# EAGLE design DACEM_Final_Bckup (EAGLE 8.4.3)
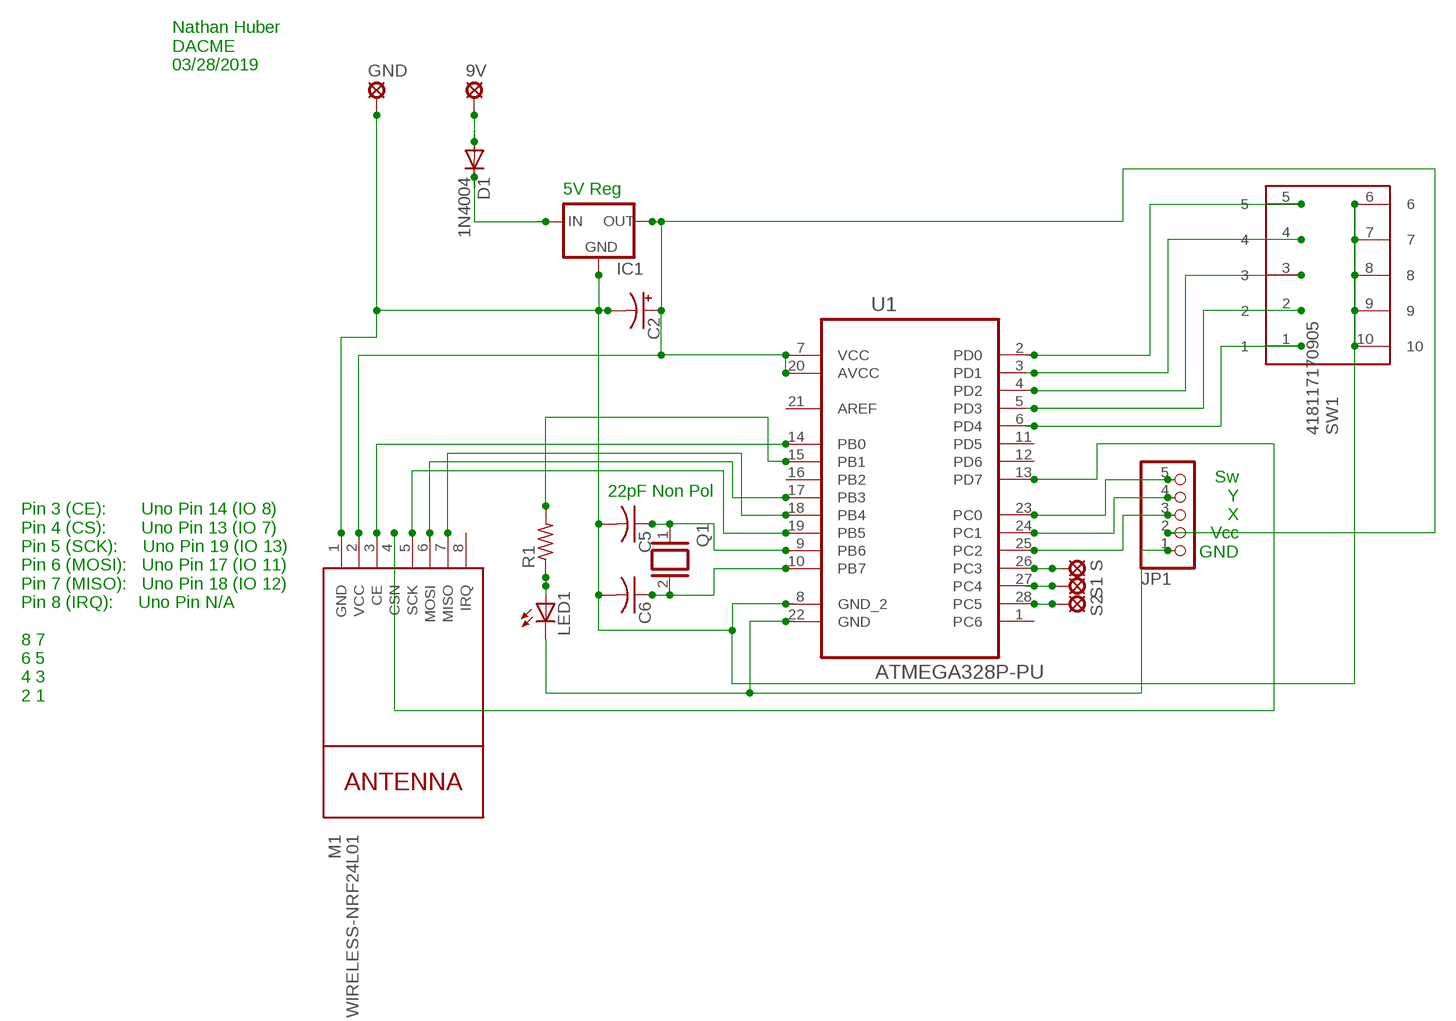
[diagram p0: schematic, sheet 1]

## Parts
9V  LSP10  [LSP10]
C2  CPOL-USE1.8-4  [E1,8-4]
C5  C-US025-025X050  [C025-025X050]
C6  C-US025-025X050  [C025-025X050]
D1  1N4004  [DO41-10]
GND  LSP10  [LSP10]
IC1  78XXS  [78XXS]
JP1  PINHD-1X5  [1X05]
LED1  LED3MM  [LED3MM]
M1  WIRELESS-NRF24L01  [WIRELESS-NRF24L01]
Q1  XTAL  [Q]
R1  R-US_0207/15  [0207/15]
S  LSP10  [LSP10]
S1  LSP10  [LSP10]
S2  LSP10  [LSP10]
SW1  418117170905  [418117170905]
U1  ATMEGA328P-PU  [DIP254P762X457-28]

## Nets
N$1: C2.- C5.2 C6.2 GND.MP IC1.GND M1.1(GND) SW1.6 SW1.7 SW1.8 SW1.9 SW1.10 U1.8(GND_2)
N$2: M1.7(MISO) U1.18(PB4)
N$3: JP1.5 U1.23(PC0)
N$4: C2.+ IC1.OUT JP1.2 M1.2(VCC) U1.7(VCC) U1.20(AVCC)
N$6: SW1.5 U1.2(PD0)
N$7: JP1.1 LED1.K(C) U1.22(GND)
N$8: JP1.4 U1.24(PC1)
N$9: JP1.3 U1.25(PC2)
N$10: C6.1 Q1.2 U1.10(PB7)
N$11: SW1.4 U1.3(PD1)
N$12: SW1.3 U1.4(PD2)
N$13: C5.1 Q1.1 U1.9(PB6)
N$14: SW1.2 U1.5(PD3)
N$15: M1.3(CE) U1.14(PB0)
N$16: M1.4(CSN) U1.13(PD7)
N$17: M1.5(SCK) U1.19(PB5)
N$18: M1.6(MOSI) U1.17(PB3)
N$19: SW1.1 U1.6(PD4)
N$21: R1.2 U1.15(PB1)
N$22: LED1.A R1.1
N$23: D1.C IC1.IN
N$24: 9V.MP D1.A
N$25: S.MP U1.26(PC3)
N$26: S1.MP U1.27(PC4)
N$27: S2.MP U1.28(PC5)
Unconnected: M1.8(IRQ) U1.1(PC6) U1.11(PD5) U1.12(PD6) U1.16(PB2) U1.21(AREF)

## Notes on the sheet
- Nathan Huber
  DACME
  03/28/2019
- 5V Reg
- Sw
  Y
  X
  Vcc
  GND
- 22pF Non Pol
- Pin 3 (CE):       Uno Pin 14 (IO 8)
  Pin 4 (CS):       Uno Pin 13 (IO 7)
  Pin 5 (SCK):     Uno Pin 19 (IO 13)
  Pin 6 (MOSI):   Uno Pin 17 (IO 11)
  Pin 7 (MISO):   Uno Pin 18 (IO 12)
  Pin 8 (IRQ):     Uno Pin N/A
  
  8 7
  6 5
  4 3
  2 1

## Library data of the parts
9V GND S S1 S2 = solpad:LSP10: SOLDER PAD drill 1.0 mm, distributor Buerklin, 12H555
C2 = rcl:CPOL-US: POLARIZED CAPACITOR, American symbol
C5 C6 = rcl:C-US: CAPACITOR, American symbol
D1 = diode:1N4004: DIODE general purpose rectifier, 1 A
IC1 = v-reg:78XXS: VOLTAGE REGULATOR
JP1 = pinhead:PINHD-1X5: PIN HEADER
LED1 = led:LED: LED OSRAM: - CHIPLED LG R971, LG N971, LY N971, LG Q971, LY Q971, LO R971, LY R971 LH N974, LH R974 LS Q976, LO Q976, LY Q976 LO Q996 - Hyper CHIPLED LW Q18S LB Q993, LB Q99A, LB R99A - SideLED LS A670, LO A670, LY A670, LG A670, LP A670 LB A673, LV A673, LT A673, LW A673 LH A674 LY A675 LS A676, LA A676, LO A676, LY A676, LW A676 LS A679, LY A679, LG A679 - Hyper Micro SIDELED® LS Y876, LA Y876, LO Y876, LY Y876 LT Y87S - SmartLED LW L88C, LW L88S LB L89C, LB L89S, LG L890 LS L89K, LO L89K, LY L89K LS L896, LA L896, LO L896, LY L896 - TOPLED LS T670, LO T670, LY T670, LG T670, LP T670 LSG T670, LSP T670, LSY T670, LOP T670, LYG T670 LG T671, LOG T671, LSG T671 LB T673, LV T673, LT T673, LW T673 LH T674 LS T676, LA T676, LO T676, LY T676, LB T676, LH T676, LSB T676, LW T676 LB T67C, LV T67C, LT T67C, LS T67K, LO T67K, LY T67K, LW E67C LS E67B, LA E67B, LO E67B, LY E67B, LB E67C, LV E67C, LT E67C LW T67C LS T679, LY T679, LG T679 LS T770, LO T770, LY T770, LG T770, LP T770 LB T773, LV T773, LT T773, LW T773 LH T774 LS E675, LA E675, LY E675, LS T675 LS T776, LA T776, LO T776, LY T776, LB T776 LHGB T686 LT T68C, LB T68C - Hyper Mini TOPLED® LB M676 - Mini TOPLED Santana® LG M470 LS M47K, LO M47K, LY M47K Source: http://www.osram.convergy.de LUXEON: - LUMILED® LXK2-PW12-R00, LXK2-PW12-S00, LXK2-PW14-U00, LXK2-PW14-V00 LXK2-PM12-R00, LXK2-PM12-S00, LXK2-PM14-U00 LXK2-PE12-Q00, LXK2-PE12-R00, LXK2-PE12-S00, LXK2-PE14-T00, LXK2-PE14-U00 LXK2-PB12-K00, LXK2-PB12-L00, LXK2-PB12-M00, LXK2-PB14-N00, LXK2-PB14-P00, LXK2-PB14-Q00 LXK2-PR12-L00, LXK2-PR12-M00, LXK2-PR14-Q00, LXK2-PR14-R00 LXK2-PD12-Q00, LXK2-PD12-R00, LXK2-PD12-S00 LXK2-PH12-R00, LXK2-PH12-S00 LXK2-PL12-P00, LXK2-PL12-Q00, LXK2-PL12-R00 Source: www.luxeon.com KINGBRIGHT: KA-3528ASYC Source: www.kingbright.com
M1 = diy-modules:WIRELESS-NRF24L01: 2.4 GHz Wireless Module based on NRF24L01 chip More details available here: http://www.electrodragon.com/w/NRF24L01 Click here to find device on ebay.com <http://www.ebay.com/sch/nrf24l01+arduino>
Q1 = special:XTAL: CRYSTAL
R1 = rcl:R-US_: RESISTOR, American symbol
SW1 = Dip_Switch:418117170905: WS-BS 2.54 mm compact THT Dip Switch with flat actuator, 5 Pole
U1 = Atmega:ATMEGA328P-PU: 8-bit Microcontroller with In-System Programmable Flash; MPN: ATMEGA328P-PU; OC_FARNELL: 1715487; OC_NEWARK: 68T2944; PACKAGE: PDIP-28; SUPPLIER: Atmel

## Board
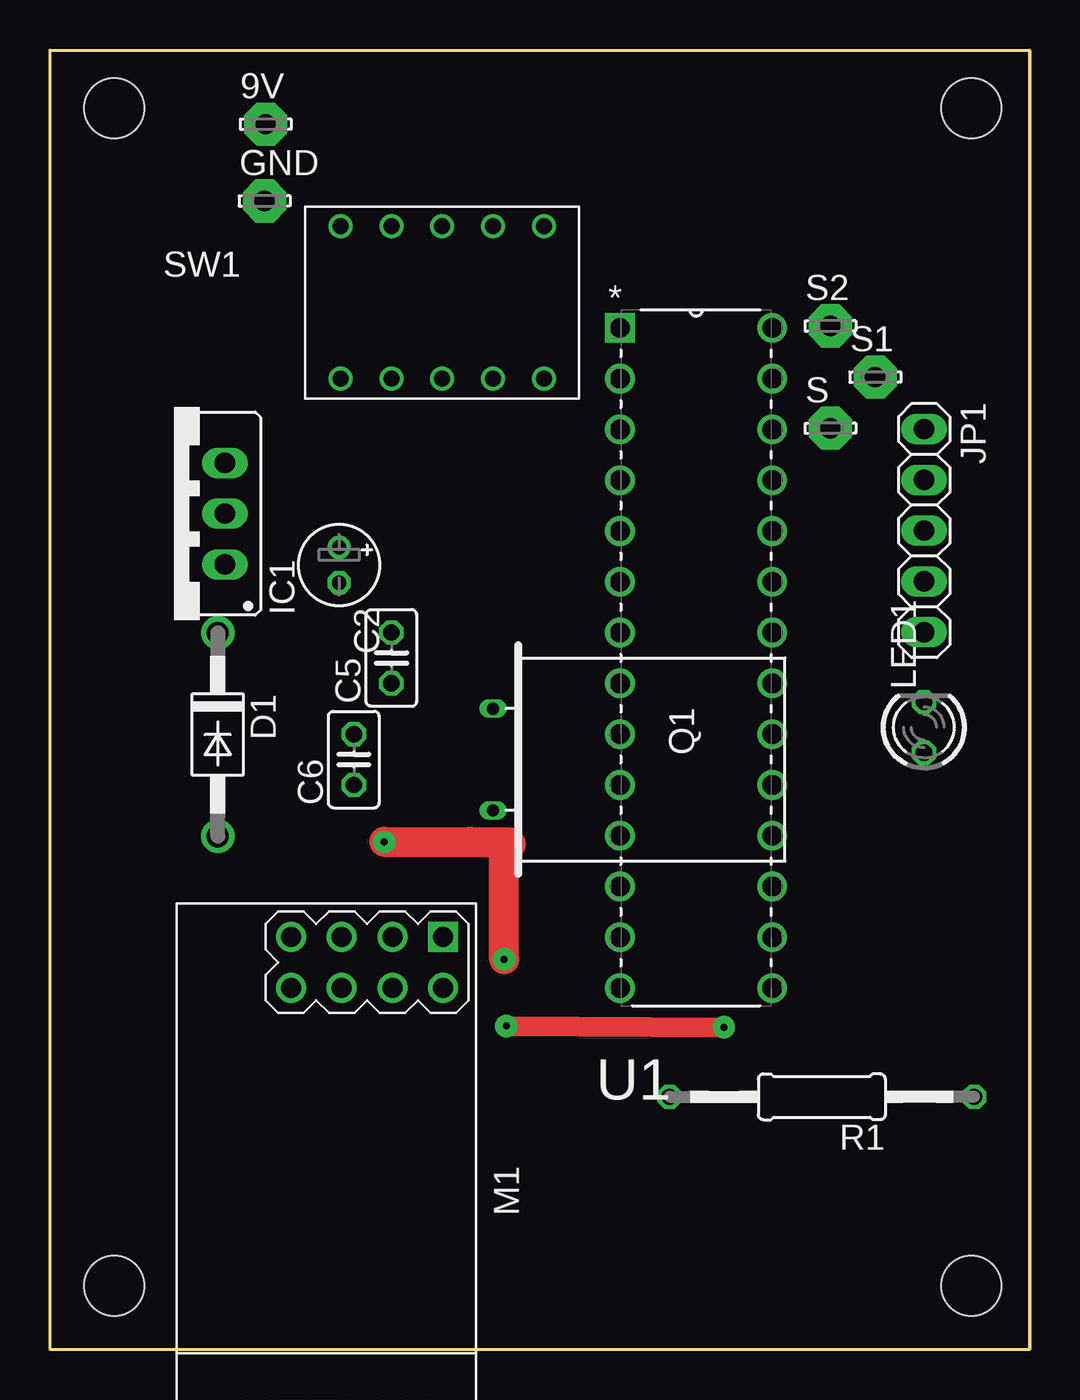
[diagram p1: board, top side]
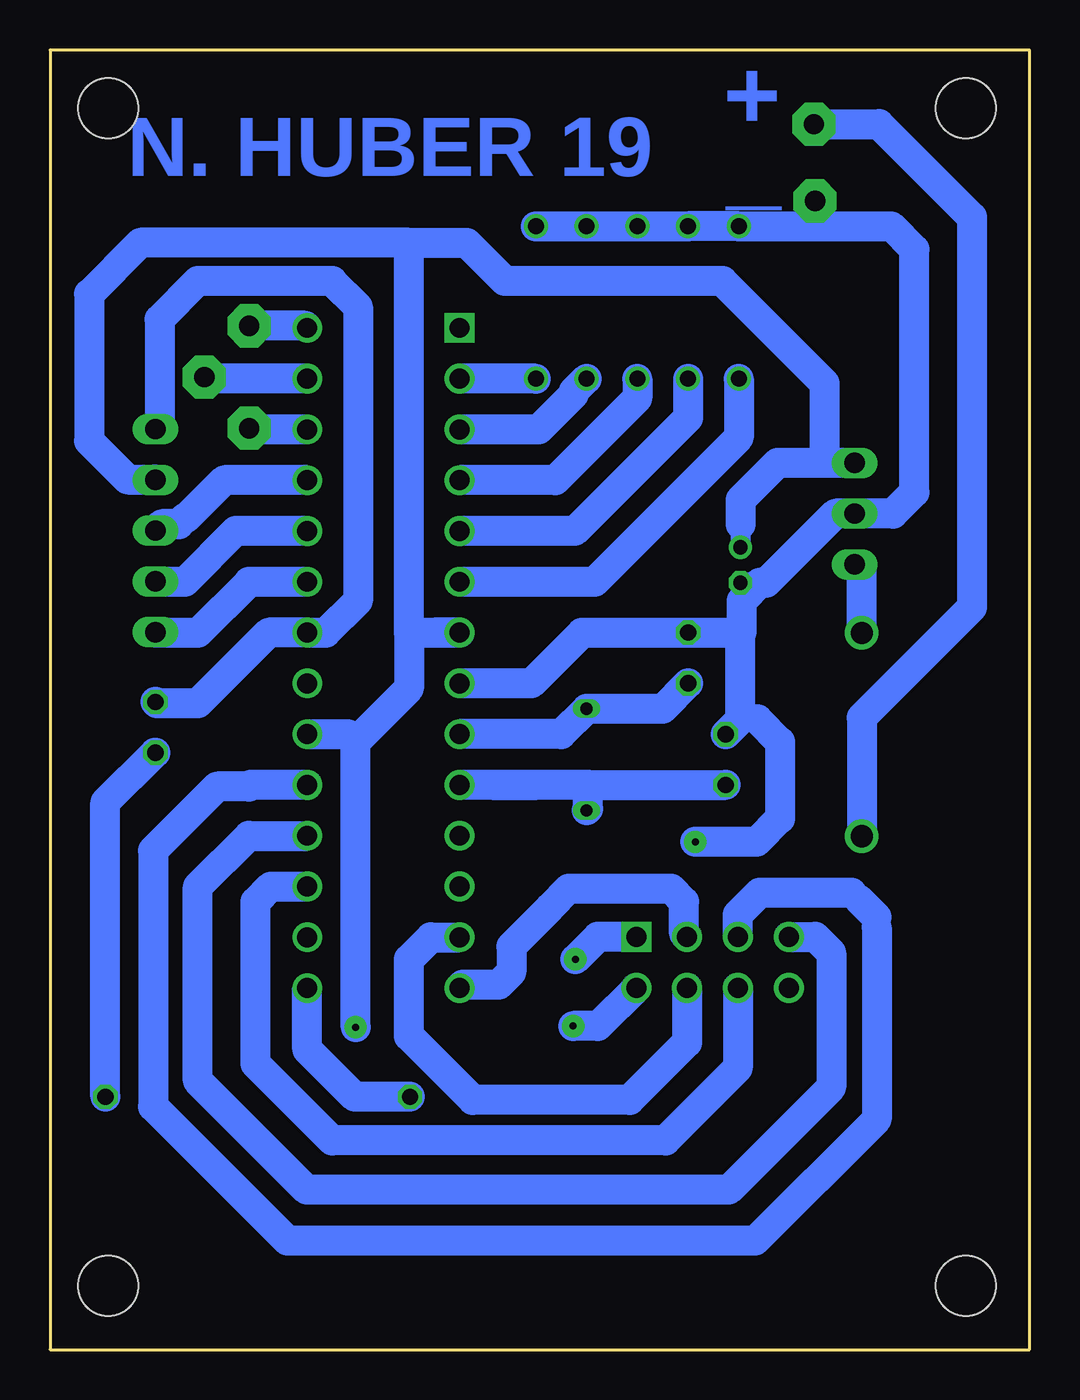
[diagram p2: board, bottom side, seen from below]

Size 49 x 65 mm. Coordinates in mm from the lower left corner, seen from the top.
Outline: 0,0 0,65 49,65 49,0 0,0
Copper layers (1*16): Top 0.035mm / dielectric 1.5mm / Bottom 0.035mm
Design rules "OthermillDRC_1_64_v2 *": minimum track width 16mil, minimum drill 5mil, track to track 0.39878125mm, track to pad 0.39878125mm, pad to pad 0.39878125mm, via to via 0.39878125mm, smd to smd 0mil, copper to edge 0mil, drill to drill 1mil, minimum pad ring 0mil, minimum via ring 15mil, stop-mask expansion 1mil, vias tented up to drill 30mil, thermal gap 10mil
Holes 3 mm at 3.2,62.08 46.08,62.08 3.2,3.2 46.08,3.2
Milling: area 0,0 to 49,65

### Footprints (pad centres in the part's own frame; a part is rotated, then mirrored left to right if it is on the bottom)
LSP10 = drill 1.016 pad 2.159 octagon: MP 0,0
E1,8-4 = drill 0.711 pad 1.168: + -0.889,0 | drill 0.711 pad 1.168 octagon: - 0.889,0
C025-025X050 = drill 0.813 octagon: 1 -1.27,0; 2 1.27,0
DO41-10 = drill 1.118: A 5.08,0; C -5.08,0
78XXS = drill 1.016 long: GND 0,-2.54; IN -2.54,-2.54; OUT 2.54,-2.54
1X05 = drill 1.016 long: 1 -5.08,0; 2 -2.54,0; 3 0,0; 4 2.54,0; 5 5.08,0
LED3MM = drill 0.813 octagon: A -1.27,0; K 1.27,0
WIRELESS-NRF24L01 = drill 1 square: 1 -12.7,6.35 | drill 1: 2 -10.16,6.35; 3 -12.7,3.81; 4 -10.16,3.81; 5 -12.7,1.27; 6 -10.16,1.27; 7 -12.7,-1.27; 8 -10.16,-1.27
Q = drill 0.61 long: 1 -2.54,-7.62; 2 2.54,-7.62
0207/15 = drill 0.813 octagon: 1 -7.62,0; 2 7.62,0
418117170905 = drill 0.8: 1 0,-3.81; 2 2.54,-3.81; 3 5.08,-3.81; 4 7.62,-3.81; 5 10.16,-3.81; 6 10.16,3.81; 7 7.62,3.81; 8 5.08,3.81; 9 2.54,3.81; 10 0,3.81
DIP254P762X457-28 = drill 0.991 square: 1 -7.62,33.02 | drill 0.991: 2 -7.62,30.48; 3 -7.62,27.94; 4 -7.62,25.4; 5 -7.62,22.86; 6 -7.62,20.32; 7 -7.62,17.78; 8 -7.62,15.24; 9 -7.62,12.7; 10 -7.62,10.16; 11 -7.62,7.62; 12 -7.62,5.08; 13 -7.62,2.54; 14 -7.62,0; 15 0,0; 16 0,2.54; 17 0,5.08; 18 0,7.62; 19 0,10.16; 20 0,12.7; 21 0,15.24; 22 0,17.78; 23 0,20.32; 24 0,22.86; 25 0,25.4; 26 0,27.94; 27 0,30.48; 28 0,33.02

### Placement (x,y rotation side)
9V  10.79,61.29 0 top
C2  14.46,39.24 270 top
C5  17.08,34.59 90 top
C6  15.2,29.51 90 top
D1  8.39,30.76 270 top
GND  10.73,57.45 0 top
IC1  6.21,41.81 90 top
JP1  43.73,40.96 270 top
LED1  43.72,31.12 90 top
M1  13.32,7.94 270 top
Q1  29.78,29.51 270 top
R1  38.61,12.64 180 top
S  39.04,46.08 0 top
S1  41.28,48.64 0 top
S2  39.04,51.2 0 top
SW1  14.54,52.37 0 top
U1  36.13,18.08 0 top

### Tracks (layer width: path | path; a pad name or v marks a point on that pad's centre or on a via)
N$1  (via drill 0.35)
  Top 1.5: v16.72,25.39 21.01,25.39 21.04,25.36 22.96,25.36 | 22.96,25.36 23.04,25.28 | v22.72,19.52 22.72,25.13 22.96,25.36
  Bottom 1: SW1.6 SW1.7 SW1.8 17.33,56.18 SW1.9 | 14.46,31.52 13.6,31.52 | 13.17,38.35 C2.- 14.4,38.29 14.4,37.44
  Bottom 1.5: SW1.6 17.33,56.18 | SW1.9 SW1.10 10.73,56.18 | 10.73,56.18 6.92,56.18 5.76,55.02 5.76,42.88 6.83,41.81 IC1.GND 9.71,41.81 13.17,38.35 13.49,38.35 14.4,37.44 14.4,35.9 14.46,35.84 | GND.MP 10.73,56.18 | 14.46,35.84 14.46,31.52 C6.2 | 13.6,31.52 12.48,30.4 12.48,26.56 13.65,25.39 v16.72,25.39 | 14.46,35.84 17.06,35.84 C5.2 17.1,35.84 22.4,35.84 24.92,33.32 U1.8 | M1.1 21.6,20.64 v22.72,19.52
N$2
  Bottom 1.5: U1.18 39.04,25.7 41.6,23.14 41.6,13.44 36.16,8 15.04,8 9.92,13.12 9.92,19.84 10.72,20.64 M1.7
N$3
  Bottom 1.5: U1.23 39.04,38.4 41.6,35.84 43.69,35.84 JP1.5
N$4  (via drill 0.35)
  Top 1: v22.83,16.18 v33.71,16.12
  Bottom 1: 28.48,35.89 U1.7 28.49,35.84 | IC1.OUT 9.79,44.35 10.24,44.8 | 14.46,41.28 C2.+
  Bottom 1.5: IC1.OUT 12.61,44.35 14.46,42.5 14.46,41.28 | 10.24,44.8 10.24,48.32 15.36,53.44 26.24,53.44 28.16,55.36 31.04,55.36 | v33.71,16.12 33.71,30.4 | 29.78,35.86 U1.7 28.53,35.84 31.04,35.84 | U1.20 34.09,30.78 33.71,30.4 | JP1.2 43.75,43.52 45.12,43.52 47.04,45.44 47.04,52.8 44.48,55.36 31.04,55.36 | 33.71,30.4 31.04,33.07 31.04,35.84 | 31.04,35.84 31.04,55.36 | M1.2 21.59,16.18 v22.83,16.18
N$6
  Bottom 1.5: SW1.5 U1.2
N$7
  Bottom 1: 36.15,35.84 U1.22
  Bottom 1.5: LED1.K 43.65,32.32 41.6,32.32 38.06,35.86 U1.22 35.22,35.86 35.2,35.84 33.6,37.44 33.6,52.16 34.88,53.44 41.6,53.44 43.52,51.52 43.52,46.25 JP1.1
N$8
  Bottom 1.5: U1.24 39.7,40.94 42.24,38.4 43.71,38.4 JP1.4
N$9
  Bottom 1.5: U1.25 40.29,43.48 42.18,41.59 42.25,41.59 42.56,41.28 43.41,41.28 JP1.3
N$10
  Bottom 1: U1.10 26.88,28.24 | 24.64,28.24 23.43,28.24
  Bottom 1.5: 22.08,28.24 C6.1 | 22.08,28.24 24.64,28.24 | 24.64,28.24 26.88,28.24 | 26.88,28.24 U1.10 | Q1.2 22.08,27.05 22.08,28.24 | 26.88,28.24 24.64,28.24
N$11
  Bottom 1.5: SW1.4 22.8,47.92 22.8,47.77 24.55,46.02 U1.3
N$12
  Bottom 1.5: U1.4 23.72,43.48 19.62,47.58 SW1.3
N$13
  Bottom 1.5: C5.1 18.35,32.05 Q1.1 23.43,30.78 U1.9
N$14
  Bottom 1.5: SW1.2 17.08,46.6 22.74,40.94 U1.5
N$15
  Bottom 1: U1.14 28,18.08
  Bottom 1.5: M1.3 17.28,20.79 17.28,22.4 17.92,23.04 23.05,23.04 24,22.09 24,22.08 25.92,20.16 25.92,18.88 26.56,18.24 28.35,18.24 U1.14
N$16
  Bottom 1: U1.13
  Bottom 1.5: M1.4 17.13,15.36 20.01,12.48 27.84,12.48 31.04,15.68 31.04,19.52 29.94,20.62 U1.13
N$17
  Bottom 1: 7.65,21.62 7.65,21.12 | 8.89,22.86 8.54,22.5
  Bottom 1.5: M1.5 14.59,21.76 13.49,22.86 8.89,22.86 | 8.54,22.5 7.65,21.62 | 7.65,21.12 7.65,11.52 13.73,5.44 37.12,5.44 43.84,12.16 43.84,24.96 40.64,28.16 39.04,28.16 38.96,28.24 U1.19
N$18
  Bottom 1.5: M1.6 14.59,14.08 18.21,10.46 34.88,10.46 38.72,14.3 38.72,22.4 37.96,23.16 U1.17
N$19
  Bottom 1.5: SW1.1 14.54,45.62 21.76,38.4 U1.6
N$21
  Bottom 1.5: U1.15 36.13,15.01 33.76,12.64 R1.2
N$22
  Bottom 1.5: LED1.A 43.75,29.85 46.23,27.37 R1.1
N$23
  Bottom 1.5: D1.C 8.39,38.91 IC1.IN
N$24
  Bottom 1.5: 9V.MP 7.53,61.29 2.88,56.64 2.88,37.12 8.39,31.61 D1.A
N$25
  Bottom 1.5: U1.26 38.98,46.02 S.MP
N$26
  Bottom 1.5: U1.27 41.2,48.56 S1.MP
N$27
  Bottom 1.5: U1.28 36.23,51.2 S2.MP

### Text on the board
Bottom: + / _ | N. HUBER 19